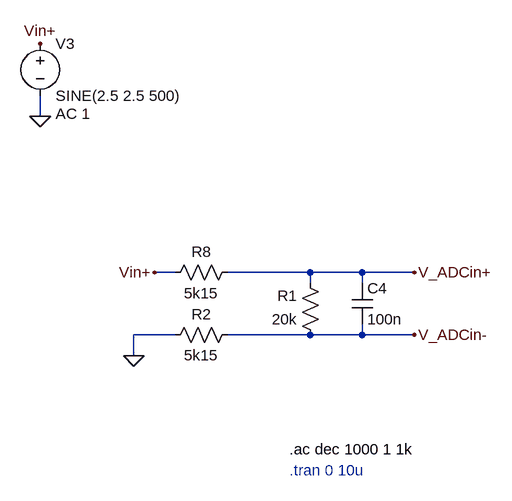
[diagram p0: schematic LS_ADC_Analog_Frontend.asc]
LS_ADC_Analog_Frontend.asc, the LTspice schematic file:
Version 4
SHEET 1 3168 1620
WIRE -640 64 -640 32
WIRE -432 304 -464 304
WIRE -224 304 -352 304
WIRE -144 304 -224 304
WIRE -64 304 -144 304
WIRE -224 320 -224 304
WIRE -144 320 -144 304
WIRE -432 400 -496 400
WIRE -224 400 -352 400
WIRE -144 400 -144 384
WIRE -144 400 -224 400
WIRE -64 400 -144 400
WIRE -496 432 -496 400
FLAG -464 304 Vin+
FLAG -640 64 0
FLAG -640 -48 Vin+
FLAG -64 304 V_ADCin+
FLAG -496 432 0
FLAG -64 400 V_ADCin-
SYMBOL res -448 320 R270
WINDOW 0 32 56 VTop 2
WINDOW 3 0 56 VBottom 2
SYMATTR InstName R8
SYMATTR Value 5k15
SYMBOL cap -160 320 R0
SYMATTR InstName C4
SYMATTR Value 100n
SYMBOL voltage -640 -64 R0
WINDOW 123 24 124 Left 2
WINDOW 39 0 0 Left 2
SYMATTR Value2 AC 1
SYMATTR InstName V3
SYMATTR Value SINE(2.5 2.5 500)
SYMBOL res -208 416 R180
WINDOW 0 36 76 Left 2
WINDOW 3 36 40 Left 2
SYMATTR InstName R1
SYMATTR Value 20k
SYMBOL res -448 416 R270
WINDOW 0 32 56 VTop 2
WINDOW 3 0 56 VBottom 2
SYMATTR InstName R2
SYMATTR Value 5k15
TEXT -256 608 Left 2 ;.tran 0 10u
TEXT -256 576 Left 2 !.ac dec 1000 1 1k

The netlist it stands for:
* LS_ADC_Analog_Frontend.asc
R8 Vin+ V_ADCin+ 5k15
C4 V_ADCin+ V_ADCin- 100n
V3 Vin+ 0 SINE(2.5 2.5 500) AC 1
R1 V_ADCin- V_ADCin+ 20k
R2 0 V_ADCin- 5k15
* .tran 0 10u
.ac dec 1000 1 1k
.backanno
.end